# EasyEDA schematic 1-Schematic_Industrial Environment Quality and Hazard Detection System.json
TITLE: Industrial Env Quality and Hazzard Monitoring; REV: 1.0; Date: 2025-01-09; Sheet: 1/1; Drawn By: Cortex Robotics; Company: BUTEX
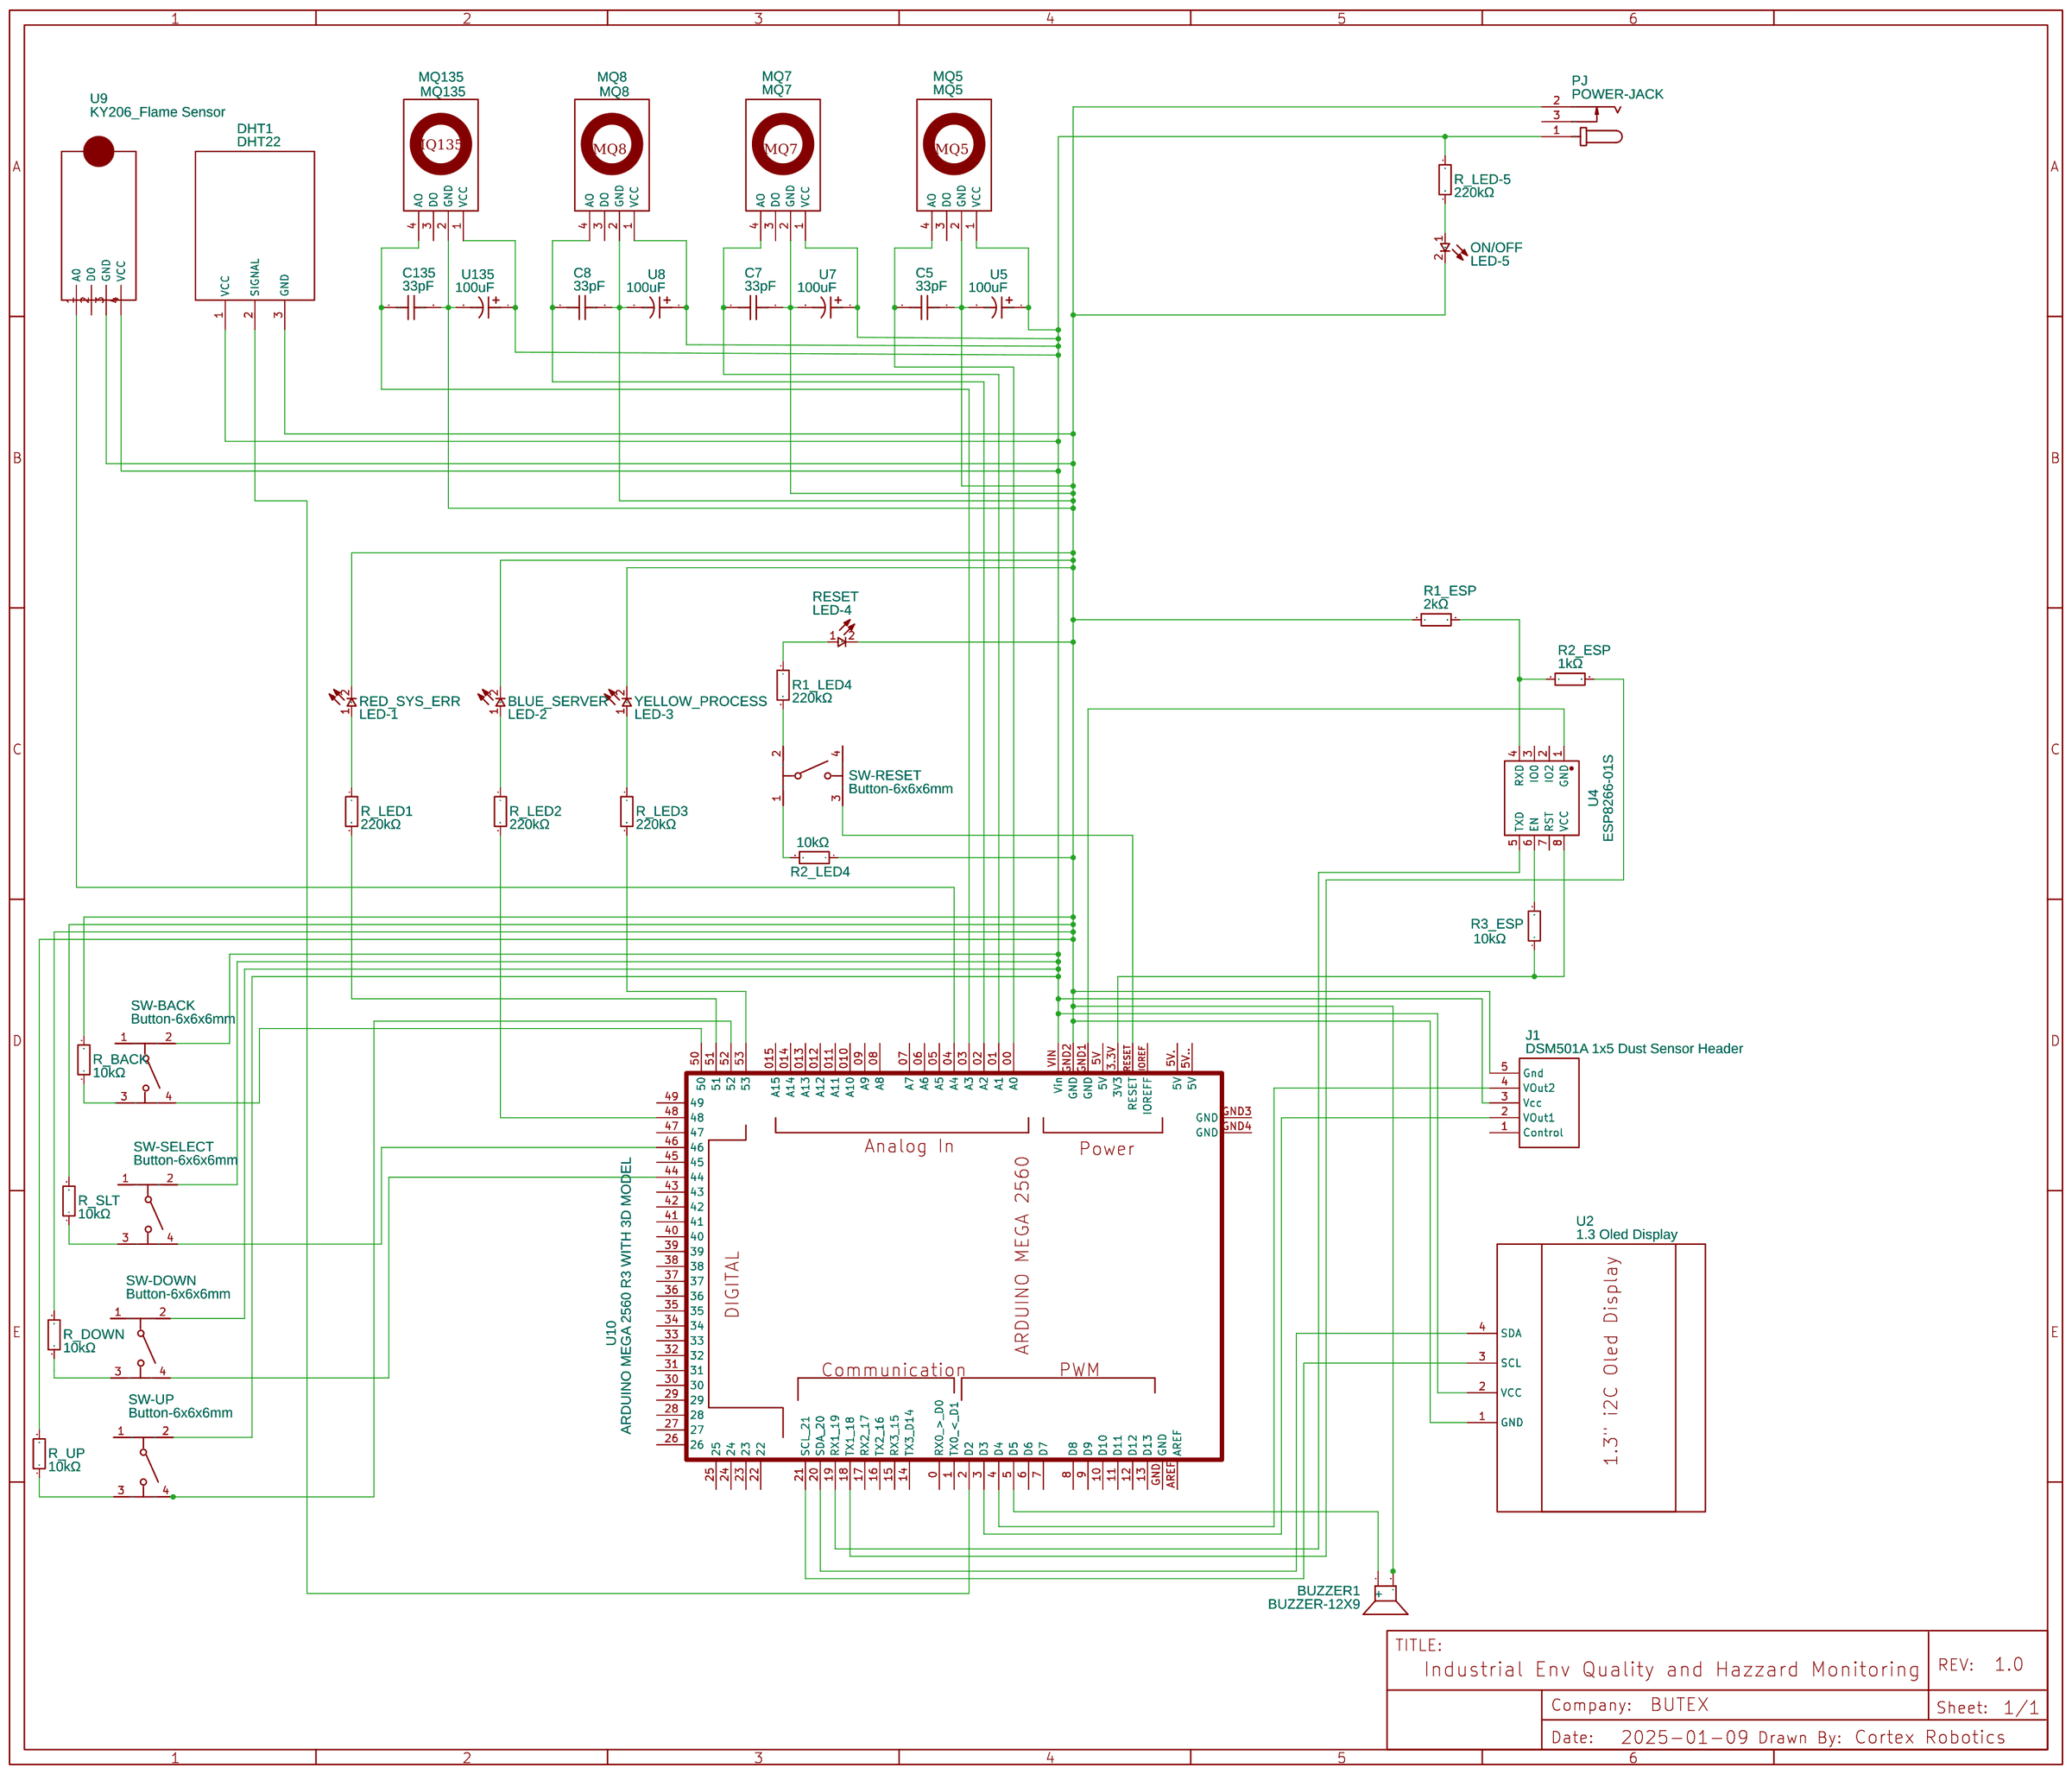
[diagram p0: schematic sheet]

## Parts
BLUE_SERVER  LED-2  [LED-TH_LED-DP2-2LED]
BUZZER1  BUZZER-12X9  [BUZ-TH_BD12.0-P7.60-D0.6-FD]
C5  33pF  [CAP-TH_L6.5-W4.0-P5.00-D1.0]
C7  33pF  [CAP-TH_L6.5-W4.0-P5.00-D1.0]
C8  33pF  [CAP-TH_L6.5-W4.0-P5.00-D1.0]
C135  33pF  [CAP-TH_L6.5-W4.0-P5.00-D1.0]
DHT1  DHT22  [DHT22]
J1  DSM501A 1x5 Dust Sensor Header  [DSM501A 1X5 DUST SENSOR HEADER]
MQ5  MQ5  [MQ7_SENSOR]
MQ7  MQ7  [MQ7_SENSOR]
MQ8  MQ8  [MQ7_SENSOR]
MQ135  MQ135  [MQ7_SENSOR]
ON/OFF  LED-5  [LED-TH_LED-DP2-2LED]
PJ  POWER-JACK  [DC-IN-TH_POWER-JACK]
R1_ESP  2kΩ  [RESISTOR]
R1_LED4  220kΩ  [RESISTOR]
R2_ESP  1kΩ  [RESISTOR]
R2_LED4  10kΩ  [RESISTOR]
R3_ESP  10kΩ  [RESISTOR]
R_BACK  10kΩ  [RESISTOR]
R_DOWN  10kΩ  [RESISTOR]
R_LED1  220kΩ  [RESISTOR]
R_LED2  220kΩ  [RESISTOR]
R_LED3  220kΩ  [RESISTOR]
R_LED-5  220kΩ  [RESISTOR]
R_SLT  10kΩ  [RESISTOR]
R_UP  10kΩ  [RESISTOR]
RED_SYS_ERR  LED-1  [LED-TH_LED-DP2-2LED]
RESET  LED-4  [LED-TH_LED-DP2-2LED]
SW-BACK  Button-6x6x6mm  [SW-TH_4P-L6.0-W6.0-P4.50-LS6.1]
SW-DOWN  Button-6x6x6mm  [SW-TH_4P-L6.0-W6.0-P4.50-LS6.1]
SW-RESET  Button-6x6x6mm  [SW-TH_4P-L6.0-W6.0-P4.50-LS6.1]
SW-SELECT  Button-6x6x6mm  [SW-TH_4P-L6.0-W6.0-P4.50-LS6.1]
SW-UP  Button-6x6x6mm  [SW-TH_4P-L6.0-W6.0-P4.50-LS6.1]
U2  1.3 Oled Display  [1.3 OLED DISPLAY]
U4  ESP8266-01S  [WIFIM-TH_ESP8266-01S]
U5  100uF  [CAP-TH_BD5.0-P2.00-D0.6-FD]
U7  100uF  [CAP-TH_BD5.0-P2.00-D0.6-FD]
U8  100uF  [CAP-TH_BD5.0-P2.00-D0.6-FD]
U9  KY206_Flame Sensor  [FLAME SENSOR]
U10  ARDUINO MEGA 2560 R3 WITH 3D MODEL  [TWIX_MEGA_PCB_ARDUINO-MEGA2560-FOOTPRINT]
U135  100uF  [CAP-TH_BD5.0-P2.00-D0.6-FD]
YELLOW_PROCESS  LED-3  [LED-TH_LED-DP2-2LED]

## Library data of the parts
BLUE_SERVER ON/OFF RED_SYS_ERR RESET YELLOW_PROCESS = LED-1 COPY COPY: Supplier: Digi-Key; Manufacturer: VccLite; Manufacturer Part: 5600; Supplier Part: L20325-ND; link: https://vcclite.com/product/5602f5-5v/; Contributor: ATE
BUZZER1 = BUZZER-12X9: Contributor: lcsc; Supplier: LCSC; Supplier Part: C9900016920; Manufacturer: null; Manufacturer Part: buzzer-12X9; JLCPCB Part Class: Extended Part
C5 C7 C8 C135 = CCBCapacitor 100PF100v: Supplier Part: C50140; Supplier: LCSC; Manufacturer: ReliaPro
DHT1 = DHT22: Manufacturer: Jared; Manufacturer Part: Jared; Supplier Part: Jared; Contributor: 201907031
J1 = DSM501A 1x5 Dust Sensor Header: Contributor: stanpak
MQ5 MQ7 MQ8 MQ135 = MQ: Contributor: cristobal.raya
PJ = POWER-JACK: Contributor: LCSC; Supplier: LCSC; Supplier Part: C9900001795; Manufacturer: 索峰; JLCPCB Part Class: Extended Part
R1_ESP R1_LED4 R2_ESP R2_LED4 R3_ESP R_BACK R_DOWN R_LED1-R_LED3 R_LED-5 R_SLT R_UP = RESISTOR NORMAL: Supplier: LCSC; Supplier Part: X16151710; Manufacturer: ResistorToday; Manufacturer Part: EWWR0001J20R0T9; Contributor: MehmetCan94
SW-BACK SW-DOWN SW-RESET SW-SELECT SW-UP = Button-6x6x6mm: Supplier Part: C71836; Supplier: LCSC; Manufacturer: BBJ; Manufacturer Part: Switch,6*6*6Plastic head,260G, 0.25mm,Straight line
U2 = 1.3 Oled Display: link: https://de.aliexpress.com/item/32276457602.html?spm=a2g0s.9042311.0.0.29cb4c4dE5zOy3; Contributor: wilfried.fabian1
U4 = ESP8266-01S: Supplier: LCSC; Supplier Part: C9900150497; Manufacturer: null; JLCPCB Part Class: Extended Part; Contributor: lcsc
U5 U7 U8 U135 = KNE2100UF10V149EC0013: Supplier: LCSC; Supplier Part: C2944313; Manufacturer: KNSCHA(科尼盛); JLCPCB Part Class: Extended Part; Contributor: lcsc
U9 = Flame Sensor: sourceId: z75rNwSCY; Supplier Part: undefined; Supplier: SeeedStudio; Contributor: yarin2558
U10 = ARDUINO MEGA 2560 R3 WITH 3D MODEL: Manufacturer: matan; Contributor: Gemini137

## Nets
Net-(BLUE_SERVER-1): BLUE_SERVER.1(A) R_LED2.1
Net-(BLUE_SERVER-2): BLUE_SERVER.2(K) BUZZER1.2 C5.2 C7.2 C8.2 C135.2 DHT1.3(GND) J1.5(Gnd) MQ5.2(GND) MQ7.2(GND) MQ8.2(GND) MQ135.2(GND) ON/OFF.2(K) PJ.2 R1_ESP.1 R2_LED4.1 R_BACK.2 R_DOWN.2 R_SLT.2 R_UP.2 RED_SYS_ERR.2(K) RESET.2(K) U2.1(GND) U5.2 U7.2 U8.2 U9.3(GND) U10.GND2(GND) U135.2 YELLOW_PROCESS.2(K)
Net-(BUZZER1-1): BUZZER1.1(+) U10.5(D5)
Net-(C5-1): C5.1 MQ5.4(AO) U10.00(A0)
Net-(C7-1): C7.1 MQ7.4(AO) U10.01(A1)
Net-(C8-1): C8.1 MQ8.4(AO) U10.02(A2)
Net-(C135-1): C135.1 MQ135.4(AO) U10.03(A3)
Net-(DHT1-1): DHT1.1(VCC) J1.3(Vcc) MQ5.1(VCC) MQ7.1(VCC) MQ8.1(VCC) MQ135.1(VCC) PJ.1 R_LED-5.1 SW-BACK.2 SW-DOWN.2 SW-SELECT.2 SW-UP.2 U2.2(VCC) U5.1 U7.1 U8.1 U9.4(VCC) U10.VIN(Vin) U135.1
Net-(DHT1-2): DHT1.2(SIGNAL) U10.2(D2)
Net-(J1-2): J1.2(VOut1) U10.3(D3)
Net-(J1-4): J1.4(VOut2) U10.4(D4)
Net-(ON/OFF-1): ON/OFF.1(A) R_LED-5.2
Net-(R1_ESP-2): R1_ESP.2 R2_ESP.1 U4.4(RXD)
Net-(R1_LED4-1): R1_LED4.1 RESET.1(A)
Net-(R1_LED4-2): R1_LED4.2 SW-RESET.2
Net-(R2_ESP-2): R2_ESP.2 U10.18(TX1 18)
Net-(R2_LED4-2): R2_LED4.2 SW-RESET.1
Net-(R3_ESP-1): R3_ESP.1 U4.8(VCC) U10.3.3V(3V3)
Net-(R3_ESP-2): R3_ESP.2 U4.6(EN)
Net-(R_BACK-1): R_BACK.1 SW-BACK.3
Net-(R_DOWN-1): R_DOWN.1 SW-DOWN.3
Net-(R_LED1-1): R_LED1.1 RED_SYS_ERR.1(A)
Net-(R_LED1-2): R_LED1.2 U10.51
Net-(R_LED2-2): R_LED2.2 U10.48
Net-(R_LED3-1): R_LED3.1 YELLOW_PROCESS.1(A)
Net-(R_LED3-2): R_LED3.2 U10.53
Net-(R_SLT-1): R_SLT.1 SW-SELECT.3
Net-(R_UP-1): R_UP.1 SW-UP.3
Net-(SW-BACK-4): SW-BACK.4 U10.50
Net-(SW-DOWN-4): SW-DOWN.4 U10.44
Net-(SW-RESET-3): SW-RESET.3 U10.RESET
Net-(SW-SELECT-4): SW-SELECT.4 U10.46
Net-(SW-UP-4): SW-UP.4 U10.52
Net-(U2-3): U2.3(SCL) U10.21(SCL 21)
Net-(U2-4): U2.4(SDA) U10.20(SDA 20)
Net-(U4-1): U4.1(GND) U10.GND1(GND)
Net-(U4-5): U4.5(TXD) U10.19(RX1 19)
Net-(U9-1): U9.1(A0) U10.04(A4)

Not connected (* = marked no-connect by the designer): J1 1(Control); MQ5 3(DO); MQ7 3(DO); MQ8 3(DO); MQ135 3(DO); PJ 3; SW-BACK 1; SW-DOWN 1; SW-RESET 4; SW-SELECT 1; SW-UP 1; U4 2(IO2) 3(IO0) 7(RST); U9 2(D0); U10 0(RX0 > D0) 1(TX0 < D1) 05(A5) 5V 5V.(5V) 5V..(5V) 06(A6) 6(D6) 07(A7) 7(D7) 08(A8) 8(D8) 09(A9) 9(D9) 010(A10) 10(D10) 011(A11) 11(D11) 012(A12) 12(D12) 013(A13) 13(D13) 014(A14) 14(TX3 D14) 015(A15) 15(RX3 15) 16(TX2 16) 17(RX2 17) 22 23 24 25 26 27 28 29 30 31 32 33 34 35 36 37 38 39 40 41 42 43 45 47 49 AREF GND GND3(GND) GND4(GND) IOREF(IOREFF)
